# EAGLE schematic fan (EAGLE 7.3.0)
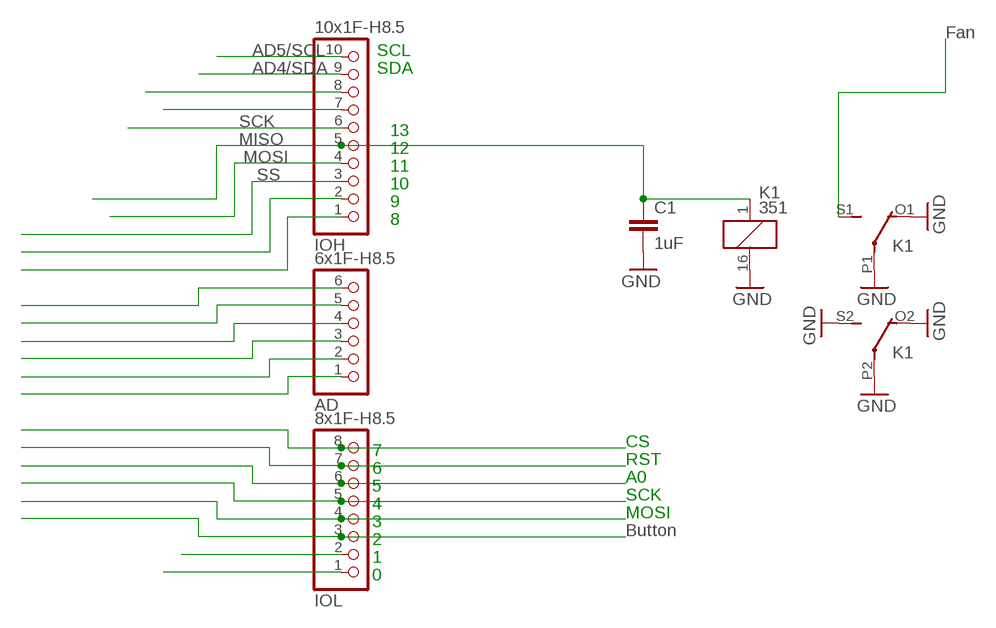
[diagram p0: schematic, sheet 1]

## Parts
AD  6x1F-H8.5  PINHD-1X6  [1X06]
C1  1uF  C2,5-3  [C2.5-3]
IOH  10x1F-H8.5  PINHD-1X10_ARD  [1X10]
IOL  8x1F-H8.5  PINHD-1X8  [1X08]
K1  351  [351]

## Nets
AD0: AD.1
AD1: AD.2
AD2: AD.3
AD3: AD.4
AD4/SDA: AD.5 IOH.9
AD5/SCL: AD.6 IOH.10
AREF [aref]: IOH.8
GND [gnd]: C1.2 IOH.7 K1.16 K1.O1(2:O) K1.O2(3:O) K1.P1(2:P) K1.P2(3:P) K1.S2(3:S)
IO0: IOL.1
IO1: IOL.2
IO2: IOL.3
IO3: IOL.4
IO4: IOL.5
IO5: IOL.6
IO6: IOL.7
IO7: IOL.8
IO8: IOH.1
IO9: IOH.2
MISO: C1.1 IOH.5 K1.1
MOSI: IOH.4
N$1: K1.S1(2:S)
SCK: IOH.6
SS: IOH.3

## Notes on the sheet
- Fan
- SCL
- SDA
- 13
- 12
- 11
- 10
- 9
- 8
- CS
- 7
- RST
- 6
- A0
- 5
- SCK
- 4
- MOSI
- 3
- Button
- 2
- 1
- 0

## Library data of the parts
AD = SmartPrj:PINHD-1X6: PIN HEADER
C1 = capacitor-wima:C: CAPACITOR naming: grid - package width
IOH = SmartPrj:PINHD-1X10_ARD: PIN HEADER
IOL = SmartPrj:PINHD-1X8: PIN HEADER
K1 = relay:351: RELAY 2 x switch, Omron; OC_FARNELL: unknown; OC_NEWARK: unknown

## Net classes
0 default: width 0.254 mm, clearance 0.254 mm
2 gnd: width 0.305 mm, drill 0.559 mm, clearance 0.254 mm
4 aref: width 0.406 mm, drill 0.61 mm, clearance 0.254 mm